# Altium schematic sheet 03_V5_TF_card.SchDoc
size A4
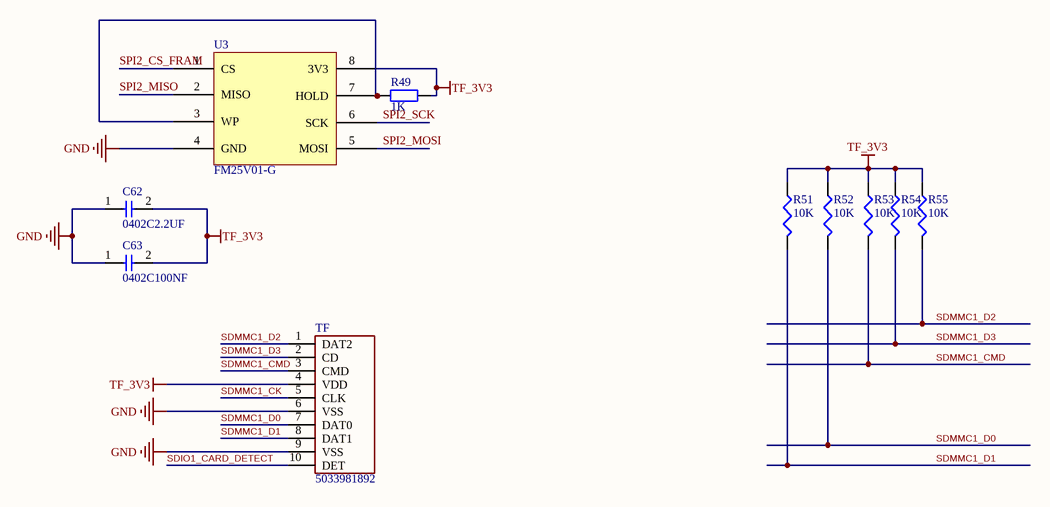
[diagram p0: 03_V5_TF_card.SchDoc]

## Parts
C62  0402C2.2UF  [0402C]
C63  0402C100NF  [0402C]
R49  1K  [R0402]
R51  10K  [R0402]
R52  10K  [R0402]
R53  10K  [R0402]
R54  10K  [R0402]
R55  10K  [R0402]
TF  5033981892  [5033981892]
U3  FM25V01-G  [SO-8]

## Nets
GND: C62.1 C63.1 TF.6(VSS) TF.9(VSS) U3.4(GND)
TF_3V3: C62.2 C63.2 R49.1 R51.1 R52.1 R53.1 R54.1 R55.1 TF.4(VDD) U3.8(3V3)
SDIO1_CARD_DETECT: TF.10(DET)
SDMMC1_CK: TF.5(CLK)
SDMMC1_CMD: R53.2 TF.3(CMD)
SDMMC1_D0: R52.2 TF.7(DAT0)
SDMMC1_D1: R51.2 TF.8(DAT1)
SDMMC1_D2: R55.2 TF.1(DAT2)
SDMMC1_D3: R54.2 TF.2(CD)
SPI2_CS_FRAM: U3.1(CS)
SPI2_MISO: U3.2(MISO)
SPI2_MOSI: U3.5(MOSI)
SPI2_SCK: U3.6(SCK)
NetR49_2: R49.2 U3.3(WP) U3.7(HOLD)

## Library data of the parts
C63 = 0402C100NF: 50V 5%
R49 = Res2: Resistor; Published: 8-Jun-2000; LatestRevisionDate: 17-Jul-2002; LatestRevisionNote: Re-released for DXP Platform.; PackageReference: AXIAL-0.4; Publisher: Altium Limited; PackageDescription: Axial Device, Thru-Hole; 2 Leads; 0.4 in Pin Spacing; Value: 1K
R51-R55 = RC0402FR-0749R9L
U3 = Component_1